# EasyEDA Pro project MasterCtrl.eprj, board MasterPCB
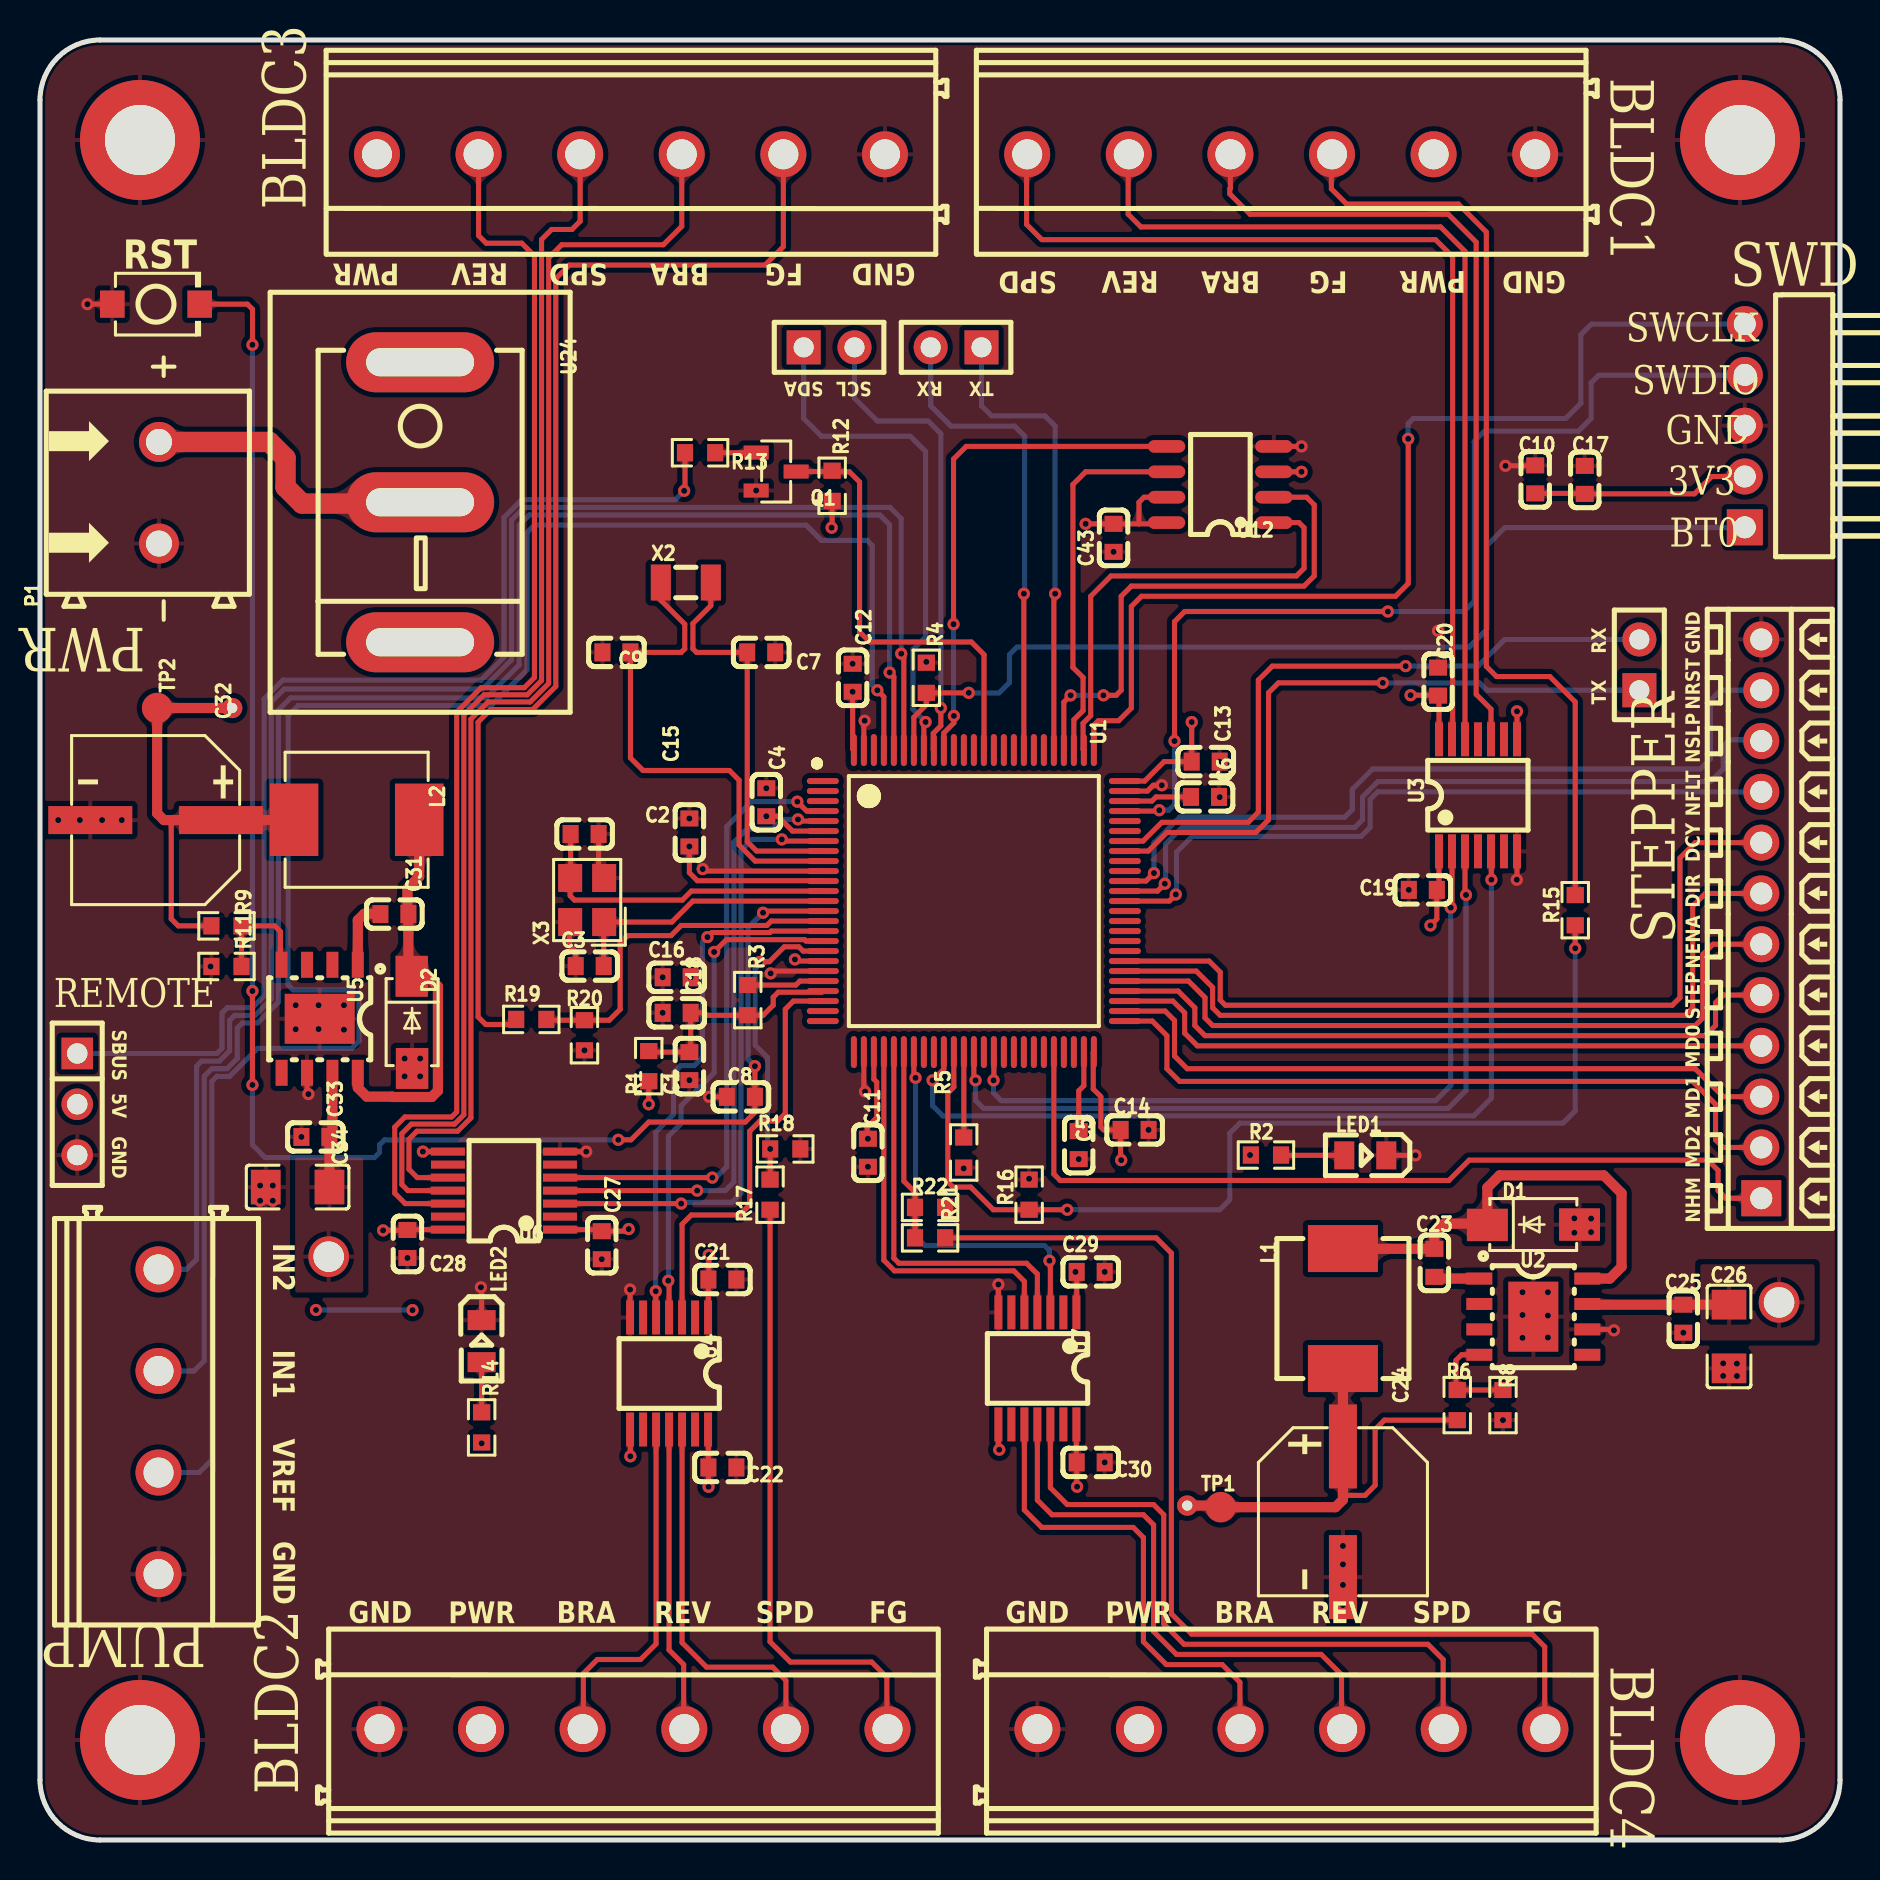
[diagram p8: board, top side]
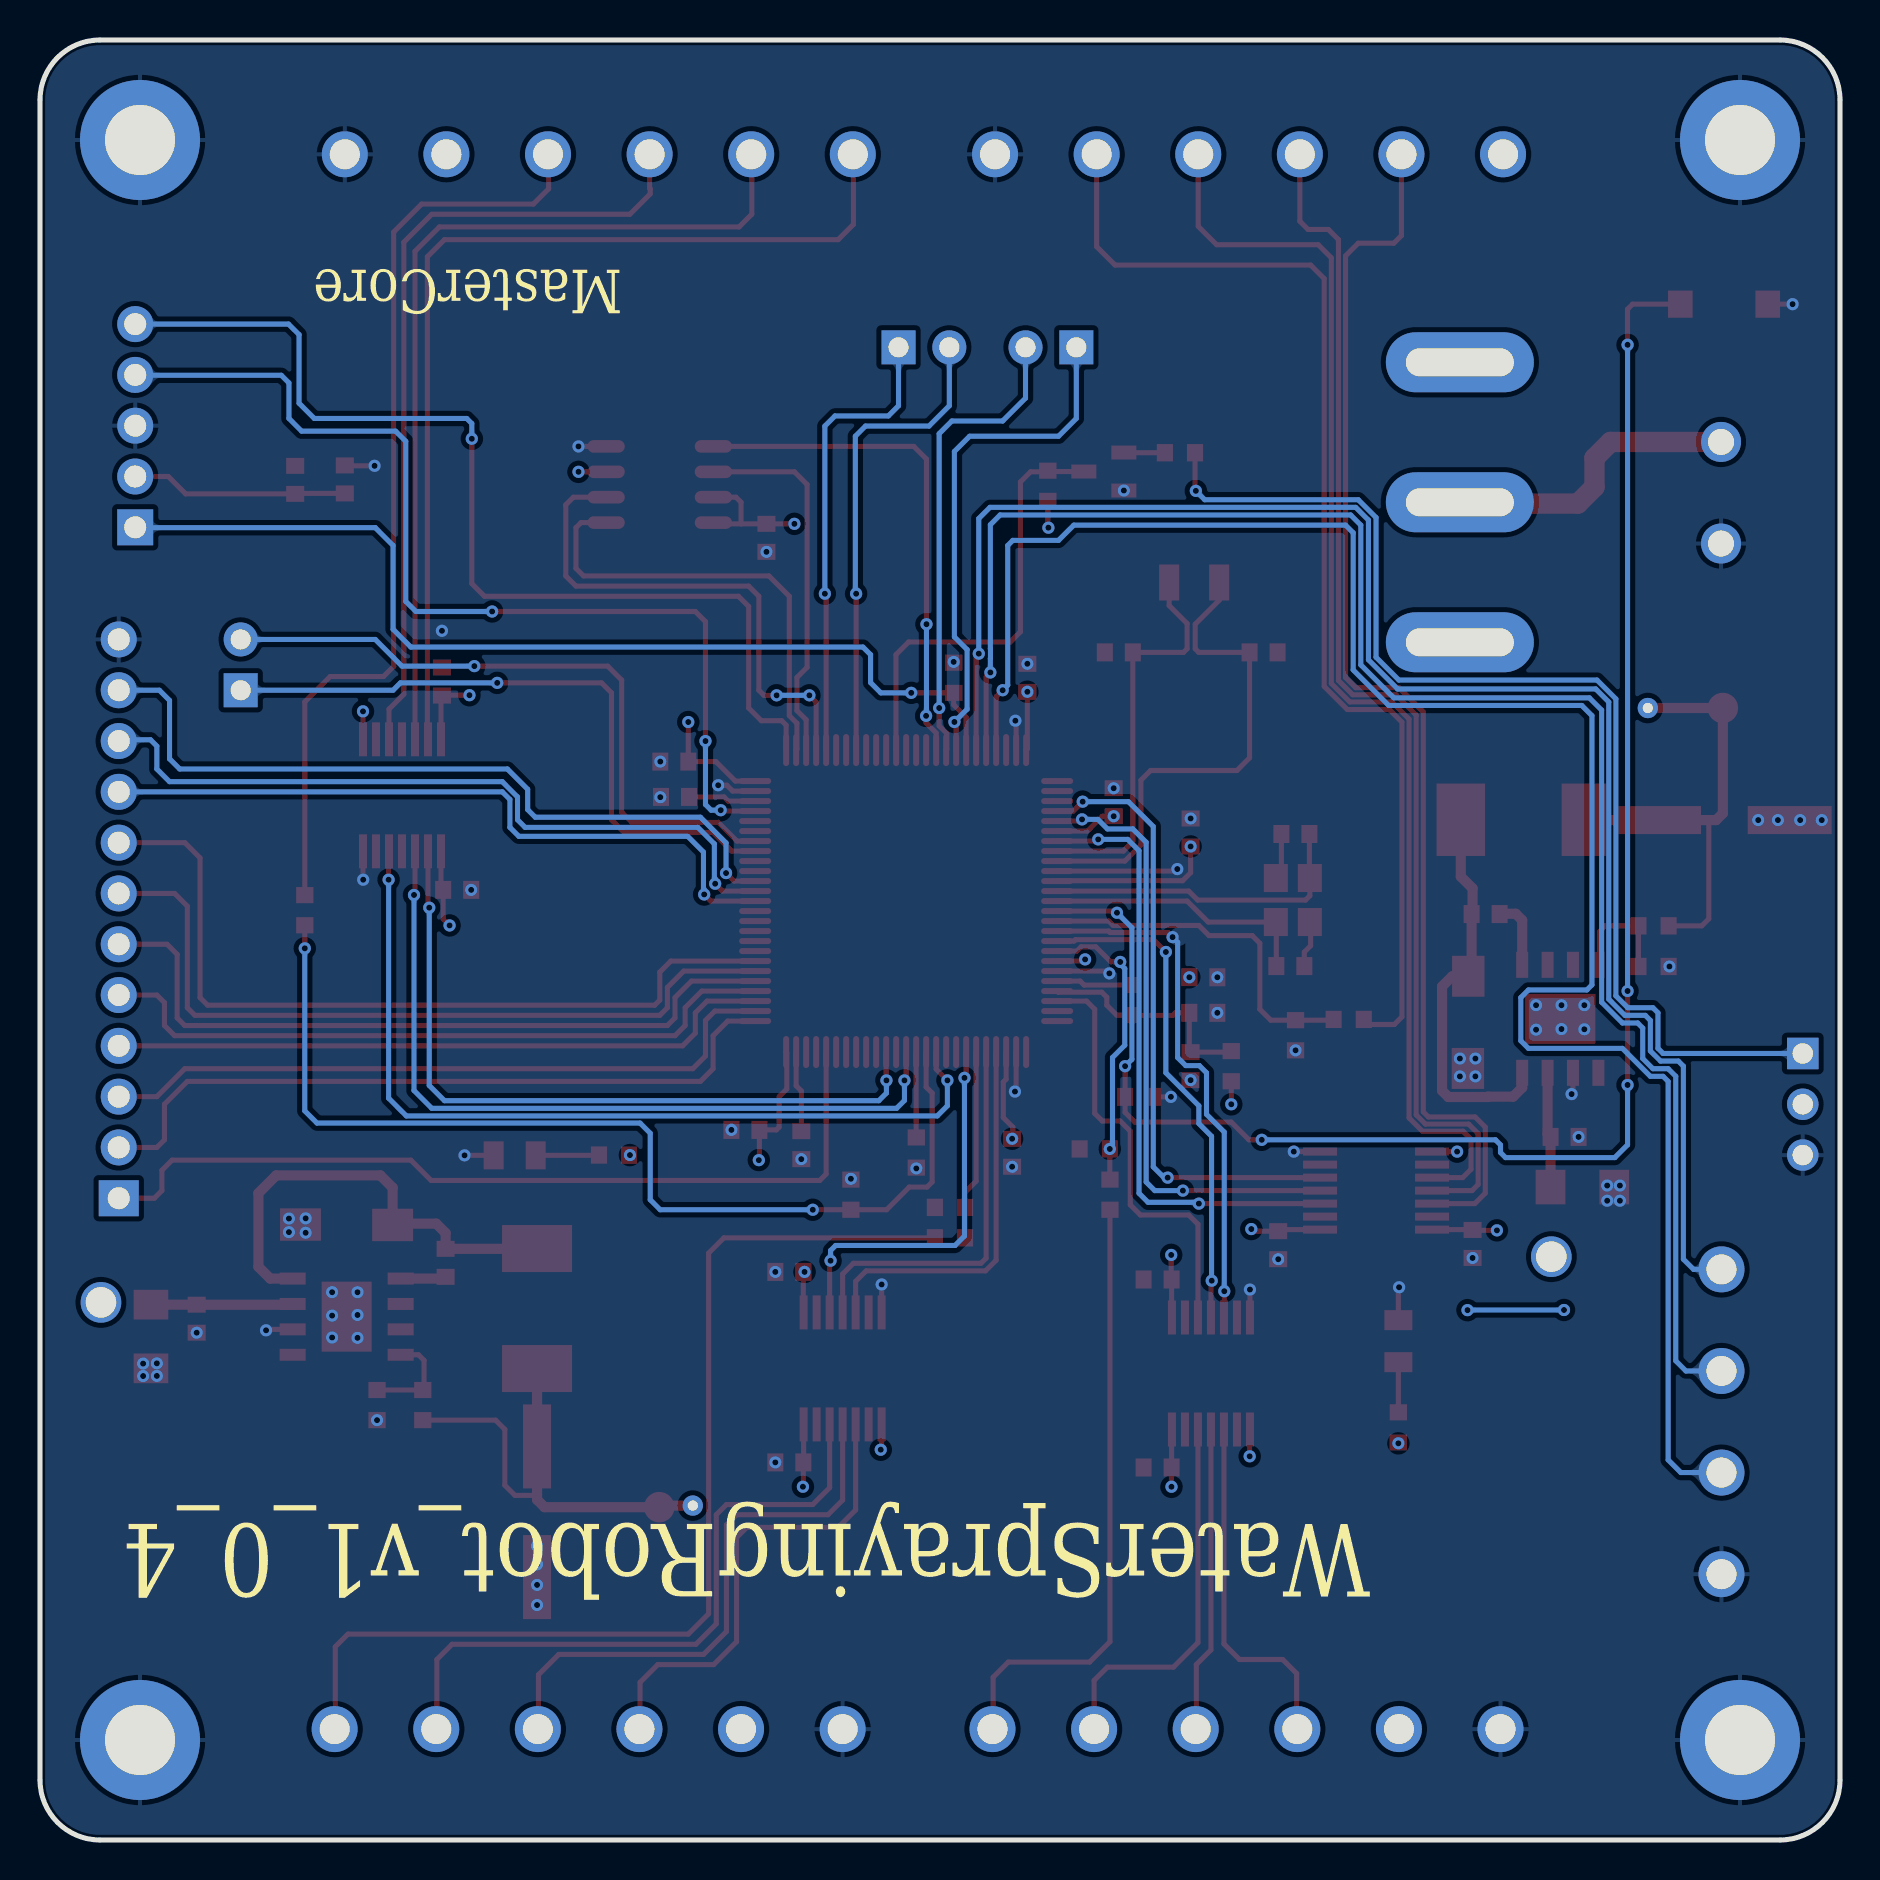
[diagram p9: board, bottom side, seen from below]

Outline 90 x 90 mm; copper layers: Top Layer, GND, PWR, Bottom Layer. Coordinates in mm from the lower left corner of the outline.
Outline path: 0,87 0,3 arc(0.88,0.88) 3,0 87,0 arc(89.12,0.88) 90,3 90,87 arc(89.12,89.12) 87,90 3,90 arc(0.88,89.12) 0,87
Stack: Top Layer 0.035mm 外层铜厚1oz / Dielectric1 0.2104mm 7628 RC49% 8.6mil / GND 0.0152mm 内层铜厚 / Dielectric2 1.065mm 1.1mm H/HOZ Copper / PWR 0.0152mm 内层铜厚 / Dielectric3 0.2104mm 7628 RC49% 8.6mil / Bottom Layer 0.035mm 外层铜厚1oz

## Design rules (mm)
template: JLCPCB Capability(Two Layers Board)
spacing copperThickness1oz (default): track to track 0.102, other pairs 0.152 to 0.3
spacing copperThickness2oz: track to track 0.203, other pairs 0.152 to 0.3
track width copperThickness1oz (default): min 0.127, default 0.254, max 2.54
track width copperThickness2oz: min 0.203, default 0.254, max 2.54
differential pair differentialPair (default): width min 0.127, default 0.254, max 2.54; gap min 0.152, default 0.152
via viaSize (default): diameter min 0.5, default 0.61, max 10; hole min 0.3, default 0.305, max 6.3

## Placement (name value [footprint] x y rotation side)
C1  100nF  [C0603]  32.47 38.69 270 top
C2  20pF  [C0603]  27.23 50.3 180 top
C3  20pF  [C0603]  27.48 43.7 0 top
C4  100nF  [C0603]  36.32 51.89 270 top
C5  2.2uF  [C0603]  51.94 34.74 90 top
C6  2.2uF  [C0603]  58.25 52.15 180 top
C7  20pF  [C0603]  36.06 59.38 180 top
C8  100nF  [C0603]  35.05 37.16 0 top
C9  20pF  [C0603]  28.82 59.38 0 top
C10  100nF  [C0603]  74.76 68.03 270 top
C11  100nF  [C0603]  41.39 34.36 90 top
C12  100nF  [C0603]  40.63 58.11 270 top
C13  100nF  [C0603]  58.29 53.92 180 top
C14  100nF  [C0603]  54.73 35.5 180 top
C15  100nF  [C0603]  32.47 50.38 270 top
C16  100nF  [C0603]  31.83 43.14 0 top
C17  10uF  [C0603]  77.24 68.01 270 top
C18  10nF  [C0603]  31.83 41.36 0 top
C19  100nF  [C0603]  69.14 47.51 180 top
C20  100nF  [C0603]  69.9 57.92 90 top
C21  100nF  [C0603]  34.12 28.02 0 top
C22  100nF  [C0603]  34.12 18.63 0 top
C23  10nF  [C0603]  69.72 28.86 270 top
C24  220uF  [CAP-SMD_BD8.0-L8.3-W8.3-FD]  65.15 16.41 270 top
C25  100nF  [C0603]  82.17 26.06 270 top
C26  10uF  [C1206]  84.45 25.17 90 top
C27  100nF  [C0603]  28.09 29.74 270 top
C28  100nF  [C0603]  18.37 29.8 270 top
C29  100nF  [C0603]  52.54 28.41 0 top
C30  100nF  [C0603]  52.54 18.88 0 top
C31  10nF  [C0603]  17.72 46.3 180 top
C32  220uF  [CAP-SMD_BD8.0-L8.3-W8.3-FD]  5.78 51 180 top
C33  100nF  [C0603]  13.77 35.15 180 top
C34  10uF  [C1206]  12.88 32.65 0 top
C43  100nF  [C0603]  53.68 65.11 90 top
CN1  DB128V-5.08-6P-GN-S  [CONN-TH_6P-P5.08_DIBO_DB128V-5.08]  62.06 84.28 180 top
CN2  DB128V-5.08-6P-GN-S  [CONN-TH_6P-P5.08_DIBO_DB128V-5.08]  29.67 5.54 0 top
CN3  DB128V-5.08-6P-GN-S  [CONN-TH_6P-P5.08_DIBO_DB128V-5.08]  29.55 84.28 180 top
CN4  DB128V-5.08-6P-GN-S  [CONN-TH_6P-P5.08_DIBO_DB128V-5.08]  62.57 5.54 0 top
CN6  DB128V-5.08-4P-GN-S  [CONN-TH_4P-P5.08_DIBO_DB128V-5.08]  5.93 20.91 270 top
D1  SS54  [SMA_L4.3-W2.6-LS5.0-FD]  74.67 30.76 180 top
D2  SS54  [SMA_L4.3-W2.6-LS5.0-FD]  18.59 40.88 90 top
H1  PZ254R-11-05P  [HDR-TH_5P-P2.54-H-M-W10.4]  85.24 70.72 90 top
H2  PM254V-11-03-H85  [HDR-TH_3P-P2.54-V-F]  1.86 36.79 270 top
L1  10uH  [IND-SMD_L7.3-W6.8]  65.15 26.57 90 top
L2  15uH  [IND-SMD_L7.0-W6.6_FXL0630]  15.83 51.01 180 top
LED1  SZYY0805R  [LED0805-R-RD]  66.26 34.23 180 top
LED2  SZYY0805R  [LED0805-R-RD]  22.08 24.94 270 top
NOREF  -  [Pad_e366]  85 85 270 top
NOREF#2  -  [Pad_e368]  85 5 270 top
NOREF#3  -  [Pad_e2298]  86.95 26.88 270 top
NOREF#4  -  [Pad_e2326]  57.36 16.72 270 top
NOREF#5  -  [Pad_e2339]  9.61 56.6 270 top
NOREF#6  -  [Pad_e369]  5 5 270 top
NOREF#7  -  [Pad_e2268]  14.44 29.17 270 top
NOREF#8  -  [Pad_e370]  5 85 270 top
P1  WJ500V-5.08-2P  [CONN-TH_2P-P5.00_WJ500V-5.08-2P]  5.95 67.36 90 top
Q1  SS8050  [SOT-23-3_L2.9-W1.3-P1.90-LS2.4-BR]  36.81 68.42 180 top
R1  0  [R0603]  30.44 38.69 90 top
R2  510  [R0603]  61.3 34.25 180 top
R3  0  [R0603]  35.39 41.99 270 top
R4  10K  [R0603]  44.32 58.11 270 top
R5  10K  [R0603]  46.19 34.37 90 top
R6  10K  [R0603]  70.86 21.75 270 top
R8  5.9kΩ  [R0603]  73.15 21.75 90 top
R9  10K  [R0603]  9.32 45.71 180 top
R11  3.24kΩ  [R0603]  9.32 43.68 0 top
R12  10K  [R0603]  39.61 67.71 270 top
R13  1K  [R0603]  33 69.36 180 top
R14  1K  [R0603]  22.08 20.63 270 top
R15  1K  [R0603]  76.76 46.49 270 top
R16  1.5K  [R0603]  49.46 32.27 90 top
R17  1K  [R0603]  36.5 32.27 90 top
R18  1.5K  [R0603]  37.26 34.55 0 top
R19  1K  [R0603]  24.56 41.03 0 top
R20  1.5K  [R0603]  27.22 40.24 270 top
R21  1K  [R0603]  44.5 30.11 180 top
R22  1.5K  [R0603]  44.5 31.63 0 top
SW1  TS-1088-AR02016  [SW-SMD_L3.9-W3.0-P4.45]  5.8 76.79 0 top
TP1  -  [Test-Point-0.5mm]  59.04 16.64 0 top
TP2  -  [Test-Point-0.5mm]  5.86 56.6 270 top
U1  STM32F407VET6TR  [LQFP-100_L14.0-W14.0-P0.50-LS16.0-BL]  46.69 46.95 270 top
U2  TPS5430DDAR  [ESOP-8_L4.9-W3.9-P1.27-LS6.0-TL-EP]  74.67 26.17 0 top
U3  RS0104YQ  [TSSOP-14_L5.0-W4.4-P0.65-LS6.4-BL]  71.9 52.24 0 top
U4  RS0104YQ  [TSSOP-14_L5.0-W4.4-P0.65-LS6.4-BL]  31.45 23.32 180 top
U5  TPS5430DDAR  [ESOP-8_L4.9-W3.9-P1.27-LS6.0-TL-EP]  13.99 41.06 270 top
U6  RS0104YQ  [TSSOP-14_L5.0-W4.4-P0.65-LS6.4-BL]  23.2 32.47 90 top
U7  RS0104YQ  [TSSOP-14_L5.0-W4.4-P0.65-LS6.4-BL]  49.87 23.58 180 top
U12  W25Q16JVSNIQ  [SOP-8_L4.9-W3.9-P1.27-LS6.0-BL]  59.01 67.78 90 top
U13  MX128-2.54-12P-GN01-Cu-Y-A  [CONN-TH_12P-P2.54_MX128-2.54-12P-GN01-CU-Y-A]  86.06 46.06 90 top
U24  RS601-1020011BB  [SW-TH_RS601-1020011BB]  19.01 66.89 270 top
U26  ZX-PM2.54-1-2PY  [HDR-TH_2P-P2.54-V-F]  79.97 58.76 90 top
U27  ZX-PM2.54-1-2PY  [HDR-TH_2P-P2.54-V-F]  39.45 74.63 0 top
U28  ZX-PM2.54-1-2PY  [HDR-TH_2P-P2.54-V-F]  45.8 74.63 180 top
X2  32.768kHz  [FC-135R_L3.2-W1.5]  32.29 62.87 0 top
X3  12MHz  [CRYSTAL-SMD_4P-L3.2-W2.5-BL]  27.36 47 90 top

## Footprints (pads in the part's own frame, mm; a bottom-side part is the same pattern mirrored in y, then rotated)
C0603
  rect 0.8x0.9 smd: 1(-0.7,0) 2(0.7,0)
C1206
  rect 1.485x1.728 smd: 1(-1.593,0) 2(1.593,0)
CAP-SMD_BD8.0-L8.3-W8.3-FD
  rect 4.2x1.4 smd: 1(-3.267,0) 2(3.267,0)
CONN-TH_2P-P5.00_WJ500V-5.08-2P
  round 2 hole 1.3: 1(-2.54,0) 2(2.54,0)
CONN-TH_4P-P5.08_DIBO_DB128V-5.08
  round 2.3 hole 1.5: 1(-7.62,0) 2(-2.54,0) 3(2.54,0) 4(7.62,0)
CONN-TH_6P-P5.08_DIBO_DB128V-5.08
  round 2.3 hole 1.5: 1(-12.7,0) 2(-7.62,0) 3(-2.54,0) 4(2.54,0) 5(7.62,0) 6(12.7,0)
CONN-TH_12P-P2.54_MX128-2.54-12P-GN01-CU-Y-A
  rect 1.8x2 hole 1.1: 1(-13.97,0)
  round 1.8 hole 1.1: 2(-11.43,0) 3(-8.89,0) 4(-6.35,0) 5(-3.81,0) 6(-1.27,0) 7(1.27,0) 8(3.81,0) 9(6.35,0) 10(8.89,0) 11(11.43,0) 12(13.97,0)
CRYSTAL-SMD_4P-L3.2-W2.5-BL
  rect 1.4x1.2 smd: 1(-1.1,-0.85) 2(1.1,-0.85) 3(1.1,0.85) 4(-1.1,0.85)
ESOP-8_L4.9-W3.9-P1.27-LS6.0-TL-EP
  rect 1.3x0.6 smd: 1(-2.7,1.905) 2(-2.7,0.635) 3(-2.7,-0.635) 4(-2.7,-1.905) 5(2.7,-1.905) 6(2.7,-0.635) 7(2.7,0.635) 8(2.7,1.905)
  rect 2.5x3.5 smd: 9(0,0)
FC-135R_L3.2-W1.5
  rect 1x1.8 smd: 1(-1.25,0) 2(1.25,0)
HDR-TH_2P-P2.54-V-F
  rect 1.7x1.7 hole 1: 1(-1.27,0)
  round 1.7 hole 1: 2(1.27,0)
HDR-TH_3P-P2.54-V-F
  rect 1.575x1.575 hole 1.02: 1(-2.54,0)
  round 1.575 hole 1.02: 2(0,0) 3(2.54,0)
HDR-TH_5P-P2.54-H-M-W10.4
  rect 1.8x1.8 hole 1.1: 1(-5.08,0)
  round 1.8 hole 1.1: 2(-2.54,0) 3(0,0) 4(2.54,0) 5(5.08,0)
IND-SMD_L7.0-W6.6_FXL0630
  rect 2.424x3.62 smd: 1(3.128,0) 2(-3.128,0)
IND-SMD_L7.3-W6.8
  rect 2.35x3.5 smd: 1(-3,0) 2(3,0)
LED0805-R-RD
  rect 1x1.399 smd: 1(1.05,0) 2(-1.05,0)
LQFP-100_L14.0-W14.0-P0.50-LS16.0-BL
  oval 0.3x1.6 smd: 1(-6,-7.55) 2(-5.5,-7.55) 3(-5,-7.55) 4(-4.5,-7.55) 5(-4,-7.55) 6(-3.5,-7.55) 7(-3,-7.55) 8(-2.5,-7.55) 9(-2,-7.55) 10(-1.5,-7.55) 11(-1,-7.55) 12(-0.5,-7.55) 13(0,-7.55) 14(0.5,-7.55) 15(1,-7.55) 16(1.5,-7.55) 17(2,-7.55) 18(2.5,-7.55) 19(3,-7.55) 20(3.5,-7.55) 21(4,-7.55) 22(4.5,-7.55) 23(5,-7.55) 24(5.5,-7.55) 25(6,-7.55) 51(6,7.55) 52(5.5,7.55) 53(5,7.55) 54(4.5,7.55) 55(4,7.55) 56(3.5,7.55) 57(3,7.55) 58(2.5,7.55) 59(2,7.55) 60(1.5,7.55) 61(1,7.55) 62(0.5,7.55) 63(0,7.55) 64(-0.5,7.55) 65(-1,7.55) 66(-1.5,7.55) 67(-2,7.55) 68(-2.5,7.55) 69(-3,7.55) 70(-3.5,7.55) 71(-4,7.55) 72(-4.5,7.55) 73(-5,7.55) 74(-5.5,7.55) 75(-6,7.55)
  oval 1.6x0.3 smd: 26(7.55,-6) 27(7.55,-5.5) 28(7.55,-5) 29(7.55,-4.5) 30(7.55,-4) 31(7.55,-3.5) 32(7.55,-3) 33(7.55,-2.5) 34(7.55,-2) 35(7.55,-1.5) 36(7.55,-1) 37(7.55,-0.5) 38(7.55,0) 39(7.55,0.5) 40(7.55,1) 41(7.55,1.5) 42(7.55,2) 43(7.55,2.5) 44(7.55,3) 45(7.55,3.5) 46(7.55,4) 47(7.55,4.5) 48(7.55,5) 49(7.55,5.5) 50(7.55,6) 76(-7.55,6) 77(-7.55,5.5) 78(-7.55,5) 79(-7.55,4.5) 80(-7.55,4) 81(-7.55,3.5) 82(-7.55,3) 83(-7.55,2.5) 84(-7.55,2) 85(-7.55,1.5) 86(-7.55,1) 87(-7.55,0.5) 88(-7.55,0) 89(-7.55,-0.5) 90(-7.55,-1) 91(-7.55,-1.5) 92(-7.55,-2) 93(-7.55,-2.5) 94(-7.55,-3) 95(-7.55,-3.5) 96(-7.55,-4) 97(-7.55,-4.5) 98(-7.55,-5) 99(-7.55,-5.5) 100(-7.55,-6)
Pad_e366
  round 6 hole 3.5: 1(0,0)
Pad_e368
  round 6 hole 3.5: 1(0,0)
Pad_e369
  round 6 hole 3.5: 1(0,0)
Pad_e370
  round 6 hole 3.5: 1(0,0)
Pad_e2268
  round 2.032 hole 1.524: 1(0,0)
Pad_e2298
  round 2.032 hole 1.524: 1(0,0)
Pad_e2326
  round 1.016 hole 0.508: 1(0,0)
Pad_e2339
  round 1.016 hole 0.508: 1(0,0)
R0603
  rect 0.806x0.864 smd: 1(-0.753,0) 2(0.753,0)
SMA_L4.3-W2.6-LS5.0-FD
  rect 2.046x1.62 smd: 1(-2.304,-0.009) 2(2.304,0.009)
SOP-8_L4.9-W3.9-P1.27-LS6.0-BL
  oval 0.63x1.865 smd: 1(-1.905,-2.683) 2(-0.635,-2.683) 3(0.635,-2.683) 4(1.905,-2.683) 5(1.905,2.683) 6(0.635,2.683) 7(-0.635,2.683) 8(-1.905,2.683)
SOT-23-3_L2.9-W1.3-P1.90-LS2.4-BR
  rect 1.25x0.7 smd: 1(1,-0.95) 2(1,0.95) 3(-1,0)
SW-SMD_L3.9-W3.0-P4.45
  rect 1.23x1.36 smd: 1(-2.185,0) 2(2.185,0)
SW-TH_RS601-1020011BB
  oval 3x7.4 hole 1.4x5.4: 1(-7,0) 2(0,0) 3(7,0)
Test-Point-0.5mm
  round 1.524 smd: 1(0,0)
TSSOP-14_L5.0-W4.4-P0.65-LS6.4-BL
  rect 0.4x1.7 smd: 1(-1.95,-2.8) 2(-1.3,-2.8) 3(-0.65,-2.8) 4(0,-2.8) 5(0.65,-2.8) 6(1.3,-2.8) 7(1.95,-2.8) 8(1.95,2.8) 9(1.3,2.8) 10(0.65,2.8) 11(0,2.8) 12(-0.65,2.8) 13(-1.3,2.8) 14(-1.95,2.8)

## Nets
As in the schematic, except:
3V3: C4.2 C10.2 C11.2 C12.2 C13.2 C14.2 C15.2 C16.2 C17.2 C19.1 C21.1 C24.1 C27.1 C29.1 C43.2 H1.2 L1.1 NOREF#4.1 R1.1 R2.2 R6.2 R12.2 TP1.1 U1.6 U1.11 U1.19 U1.28 U1.50 U1.75 U1.100 U3.1 U3.8 U4.1 U4.8 U6.1 U6.8 U7.1 U7.8 U12.3 U12.7 U12.8
5V: C20.1 C22.1 C28.1 C30.1 C32.1 H2.2 L2.1 NOREF#5.1 R9.2 R14.2 TP2.1 U3.14 U4.14 U6.14 U7.14
GND: C1.2 C2.1 C3.1 C4.1 C5.1 C6.1 C7.1 C8.1 C9.1 C10.1 C11.1 C12.1 C13.1 C14.1 C15.1 C16.1 C17.1 C18.1 C19.2 C20.2 C21.2 C22.2 C24.2 C25.2 C26.1 C27.2 C28.2 C29.2 C30.2 C32.2 C33.2 C34.1 C43.1 CN1.1 CN2.1 CN3.1 CN4.1 CN6.4 D1.1 D2.1 H1.3 H2.3 LED1.2 LED2.2 NOREF.1 NOREF#2.1 NOREF#6.1 NOREF#8.1 P1.1 Q1.2 R4.1 R5.1 R8.1 R11.1 R16.2 R18.2 R20.2 R22.2 SW1.1 U1.10 U1.20 U1.27 U1.74 U1.99 U2.6 U2.9 U3.7 U4.7 U5.6 U5.9 U6.7 U7.7 U12.4 U13.12 X3.2 X3.4
VIN_24V: C25.1 C26.2 C33.1 C34.2 NOREF#3.1 NOREF#7.1 U2.7 U5.7 U24.3

Pads without a net: U1 1 2 3 24 25 26 33 34 39 41 42 43 44 45 47 48 58 59 60 61 62 66 67 70 71 81 82 84 85 86 88 89 90 98; U2 2 3 5; U3 4 6 9 11; U4 2 6 9 13; U5 2 3 5; U6 2 6 9 13; U7 2 6 9 13; U24 1

## Via types
v1: diameter 0.61, hole 0.305, Top Layer to Bottom Layer, 158 vias

## Routing (per net, layer and track width the routed paths; a pad name or vN(x,y) marks a point on that pad's centre or on a via; arc(x,y) is an arc through that point)
3V3: length 95.4
  Top Layer w0.254: U4.8 29.52,20.51 v1(29.52,19.19) ; v1(33.44,29.25) 33.44,28.04 C21.1 33.42,26.14 U4.1 ; v1(32.47,49.68) 32.47,48.36 32.87,47.96 39.13,47.96 U1.11 ; v1(69.52,45.73) 69.84,46.05 C19.1 69.95,47.61 U3.1 ; U6.8 v1(19.15,34.42) ; v1(47.96,19.51) 47.92,19.56 47.92,20.78 ; v1(51.77,28.41) C29.1 51.83,26.4 U7.1 ; R1.1 v1(30.44,36.79) ; 54.94,65.81 54.95,65.82 54.95,66.89 55.2,67.14 U12.7 ; 54.94,65.81 C43.2 v1(52.28,65.81) ; 54.94,65.81 56.27,65.81 U12.8 ; R12.2 39.61,65.64 v1(39.58,65.62) ; U1.28 41.69,38.04 41.84,37.9 41.84,36.12 41.36,35.64 41.36,35.1 v1(41.39,35.06) ; U3.8 v1(73.85,56.43) ; 61.69,68.41 v1(63.08,68.41) ; v1(37.75,44.03) 37.83,43.95 U1.19 ; R6.2 67.22,20.99 66.76,20.53 66.76,17.74 66.25,17.23 65.2,17.23 65.15,17.28 ; U6.1 28.01,30.52 C27.1 29.33,30.44 v1(29.43,30.55) ; H1.2 83.59,68.17 82.72,67.31 C17.2 77.22,67.33 C10.2 ; v1(36.32,51.19) 36.88,51.19 37.63,50.45 U1.6 ; v1(54.06,33.99) 54.03,34.02 C14.2 53.18,35.5 53.04,35.64 53.04,37.17 52.66,37.55 52.66,39.37 U1.50 ; U1.75 55.23,52.95 56.21,53.92 57.59,53.92 v1(57.59,55.9) ; 40.74,57.36 40.69,57.41 v1(40.63,57.41) 40.63,54.56 U1.100
  Top Layer w0.508: L1.1 C24.1 65.15,17.01 64.77,16.64 TP1.1 58.96,16.72 NOREF#4.1
  vias: v1(32.53,43.14) v1(60.5,34.25)
5V: length 198.3
  Top Layer w0.254: v1(51.85,17.66) 51.83,17.68 C30.1 51.82,18.9 U7.14 ; v1(33.43,17.66) 33.43,18.62 C22.1 33.42,20.51 U4.14 ; 6.52,51 6.56,50.96 6.56,46.06 6.91,45.71 R9.2 ; U3.14 69.95,57.17 C20.1 69.88,57.24 v1(68.53,57.24) ; v1(17.15,30.48) 18.35,30.48 C28.1 18.39,30.52 U6.14
  Top Layer w0.508: L2.1 12.69,51 C32.1 6.2,51 5.86,51.33 TP2.1 9.48,56.6 9.61,56.47
  PWR w0.254: H2.2 3.51,36.79 3.89,36.41 3.89,27.64 5.04,26.5 v1(13.8,26.5) ; v1(22.08,19.84) 22.08,17.67 22.08,17.66 ; 22.08,17.66 19.48,17.66 18.63,18.52 v1(18.63,26.49) 18.63,27.9 18.09,28.43 18.09,28.43 17.15,29.37 v1(17.15,30.48) 17.1,30.53 17.1,55.96 16.47,56.6 NOREF#5.1 ; 22.08,17.66 v1(33.43,17.66) v1(51.85,17.66) 55.64,17.66 56.22,18.25 56.22,39.96 57.23,40.98 64.09,40.98 64.6,41.49 64.6,56.43 65.41,57.24 v1(68.53,57.24)
  Bottom Layer w0.254: v1(18.63,26.49) 18.62,26.5 v1(13.8,26.5)
GND: length 34.9
  Top Layer w0.254: U1.74 55.37,52.45 55.66,52.74 v1(56.09,52.74) ; v1(41.23,55.96) 41.19,55.92 U1.99 ; U1.10 33.24,48.45 v1(33.14,48.55) ; v1(22.05,27.64) 22.08,27.6 LED2.2 ; U2.6 78.65,25.53 v1(78.7,25.48) ; U6.7 v1(27.31,34.42) ; U1.27 41.19,37.48 v1(41.25,37.42) ; U12.4 v1(63.08,69.68) ; v1(73.27,68.71) 74.74,68.71 C10.1 ; U5.6 13.35,37.36 v1(13.42,37.3) ; U4.7 v1(29.5,27.52) ; 28.21,48.1 27.93,48.38 C2.1 ; v1(2.37,76.79) SW1.1 ; C3.1 26.79,44.4 26.47,44.71 26.47,45.86 26.51,45.9 ; U1.20 36.65,43.45 v1(36.53,43.33) ; 47.92,26.38 v1(47.92,27.78) ; C8.1 v1(33.46,37.16) ; v1(73.84,48.01) 73.85,48.02 U3.7 ; LED1.2 v1(68.77,34.23)
  vias: v1(0.91,51) v1(1.99,51) v1(3.1,51) v1(4.09,51) v1(8.53,43.68) v1(11.01,32.72) v1(11.01,31.96) v1(11.64,32.72) v1(11.64,31.96) v1(12.78,41.74) v1(12.78,40.54) v1(13.07,35.15) v1(13.93,41.74) v1(13.93,40.55) v1(15.2,41.74) v1(15.2,40.52) v1(18.23,39.07) v1(18.23,38.18) v1(18.37,29.1) v1(19.01,39.07) v1(19.01,38.18) v1(27.22,39.48) v1(28.09,29.04) v1(31.13,43.14) v1(31.13,41.36) v1(32.47,51.08) v1(32.47,37.99) v1(35.81,67.47) v1(36.32,52.59) v1(40.63,58.81) v1(41.39,33.66) v1(44.32,58.91) v1(46.19,33.58) v1(49.46,33.06) v1(51.94,34.04) v1(53.23,28.41) v1(53.23,18.88) v1(53.68,64.41) v1(55.43,35.5) v1(58.99,53.92) v1(58.99,52.14) v1(65.15,14.7) v1(65.15,13.78) v1(65.15,12.75) v1(65.15,11.75) v1(68.44,47.51) v1(69.9,60.46) v1(73.15,20.99) v1(74.13,27.39) v1(74.13,26.25) v1(74.13,25.11) v1(75.39,27.39) v1(75.39,26.22) v1(75.39,25.12) v1(76.72,31.08) v1(76.72,30.36) v1(77.55,31.07) v1(77.55,30.39) v1(82.17,25.36) v1(84.16,23.83) v1(84.16,23.2) v1(84.84,23.82) v1(84.84,23.2)
VDDA: length 11.4
  Top Layer w0.254: U1.22 39.09,42.39 36.91,42.39 36.66,42.14 36.66,41.74 36.16,41.24 R3.2 35.38,41.23 33.36,41.23 33.23,41.36 C18.2 32.53,39.46 C1.1 30.49,39.39 R1.2
VIN_24V: length 165.2
  Top Layer w0.508: U5.7 14.62,35.3 C33.1 ; U2.7 77.4,26.76 C25.1 82.17,26.77 C26.2 ; 14.47,35.15 C34.2
  PWR w1.524: U24.3 10.86,59.89 6.69,55.71 6.69,30.82 8.4,29.1 14.37,29.1 NOREF#7.1 15.83,29.17 17.1,27.9 17.1,12.66 19.52,10.24 85.17,10.24 86.95,12.02 NOREF#3.1
BLDC1_BRA: length 40.5
  Top Layer w0.254: U3.10 72.55,56.54 71.81,57.28 71.81,79.89 70.41,81.29 60.51,81.29 59.49,82.3 59.49,82.56 59.52,82.59 CN1.4
BLDC1_BRA_3V3: length 43.8
  Top Layer w0.254: v1(44.63,37.98) 45.19,38.54 U1.35 ; U3.5 72.57,49.42 v1(72.57,48.01)
  Bottom Layer w0.254: v1(72.57,48.01) 72.57,37.09 71.68,36.2 45.14,36.2 44.63,36.71 v1(44.63,37.98)
BLDC1_FG: length 46.9
  Top Layer w0.254: R15.1 76.76,56.9 75.49,58.17 72.82,58.17 72.32,58.68 72.32,80.4 70.92,81.8 65.33,81.8 64.57,82.56 64.57,84.25 CN1.3
BLDC1_FG_3V3: length 51.8
  Top Layer w0.254: v1(51.36,31.51) R16.1 47.67,31.51 46.54,32.65 45.65,32.65 45.39,32.9 45.39,37.35 45.69,37.65 U1.36 ; v1(76.76,44.58) R15.2
  Bottom Layer w0.254: v1(51.36,31.51) 58.99,31.51 59.49,32.01 59.49,35.34 60,35.85 76.15,35.85 76.76,36.46 v1(76.76,44.58)
BLDC1_PWM: length 49.6
  Top Layer w0.254: CN1.6 49.33,84.25 49.33,80.78 50.09,80.02 69.78,80.02 70.63,79.16 70.63,55.07 70.6,55.04
BLDC1_PWM_3V3: length 37.1
  Top Layer w0.254: v1(47.68,37.98) 47.69,38 U1.40 ; v1(70.54,46.62) 70.6,46.68 70.6,49.44
  Bottom Layer w0.254: v1(47.68,37.98) 47.68,37.35 48.06,36.97 69.78,36.97 70.54,37.73 v1(70.54,46.62)
BLDC1_REV: length 45
  Top Layer w0.254: CN1.5 54.41,84.25 54.41,81.29 55.04,80.65 70.03,80.65 71.25,79.43 U3.12
BLDC1_REV_3V3: length 39.5
  Top Layer w0.254: U1.38 46.69,38.06 v1(46.78,37.98) ; v1(71.3,47.25) 71.25,47.3 U3.3
  Bottom Layer w0.254: v1(71.3,47.25) 71.3,37.47 70.41,36.58 47.17,36.58 46.78,36.98 v1(46.78,37.98)
BLDC2_BRA: length 17.8
  Top Layer w0.254: CN2.3 27.17,5.58 27.17,8.33 27.87,9.03 30.02,9.03 30.8,9.8 U4.10
BLDC2_BRA_3V3: length 26.4
  Top Layer w0.254: v1(33.37,45.14) 33.6,45.37 36.49,45.37 36.57,45.45 U1.16 ; v1(30.79,27.44) 30.79,26.14 U4.5
  Bottom Layer w0.254: v1(33.37,45.14) 33.12,44.89 33.12,39.12 32.71,38.72 32.03,38.72 31.68,38.36 31.68,36.28 30.79,35.4 v1(30.79,27.44)
BLDC2_FG: length 30.8
  Top Layer w0.254: R17.1 36.5,9.91 37.52,8.9 41.58,8.9 42.34,8.14 42.34,5.58 CN2.6
BLDC2_FG_3V3: length 14.8
  Top Layer w0.254: v1(35.99,43.9) 36.28,43.9 36.29,43.91 36.47,43.91 37.21,44.66 37.94,44.66 38.16,44.45 U1.18 ; v1(36.51,34.55) 36.51,33.03 R17.2
  Bottom Layer w0.254: v1(35.99,43.9) 35.99,43.8 35.76,43.57 35.76,39.74 36.38,39.12 36.38,34.69 v1(36.51,34.55)
BLDC2_PWM: length 19.1
  Top Layer w0.254: U4.12 32.1,9.87 33.33,8.64 36.63,8.64 37.3,7.98 CN2.5
BLDC2_PWM_3V3: length 21.5
  Top Layer w0.254: U1.23 37.67,41.95 37.26,41.54 37.26,36.33 36.88,35.95 35.99,35.95 35.49,35.44 35.49,31.76 34.98,31.25 32.57,31.25 32.1,30.79 U4.3
BLDC2_REV: length 15.3
  Top Layer w0.254: U4.11 31.45,9.5 32.18,8.77 32.18,5.58 CN2.4
BLDC2_REV_3V3: length 25
  Top Layer w0.254: U4.4 31.45,27.93 v1(31.41,27.96) ; v1(33.71,44.4) 34.32,45.02 38.23,45.02 38.3,44.95 U1.17
  Bottom Layer w0.254: v1(33.71,44.4) 33.71,38.36 32.06,36.71 32.06,35.82 31.42,35.19 31.42,27.97 v1(31.41,27.96)
BLDC3_BRA: length 63.9
  Top Layer w0.254: CN3.3 32.09,80.68 31.17,79.76 26.09,79.76 25.43,79.11 25.43,57.83 24.51,56.9 22.41,56.9 21.55,56.05 21.55,36.11 21.52,36.08 21.52,36.08 20.88,35.44 18.85,35.44 18.45,35.04 18.45,33.54 18.87,33.12 U6.10
BLDC3_BRA_3V3: length 31.1
  Top Layer w0.254: v1(37.86,51.92) 38.34,51.45 U1.4 ; U6.5 v1(33.62,33.12)
  Bottom Layer w0.254: v1(37.86,51.92) 35.58,51.92 34.34,50.67 34.34,33.66 33.83,33.16 33.65,33.16 v1(33.62,33.12)
BLDC3_FG: length 58.6
  Top Layer w0.254: R19.1 23.56,40.78 22.28,40.78 21.9,41.16 21.9,55.89 22.53,56.52 24.63,56.52 25.79,57.68 25.79,78.07 26.47,78.75 36.25,78.75 37.17,79.67 CN3.2
BLDC3_FG_3V3: length 17.8
  Top Layer w0.254: U1.15 36.56,45.95 36.34,45.73 32.06,45.73 31.55,45.22 29.39,45.22 29.01,44.84 29.01,41.54 28.46,40.99 R20.1 25.36,40.99 R19.2
BLDC3_PWM: length 60.8
  Top Layer w0.254: CN3.4 27.01,80.94 26.6,80.53 25.58,80.53 25.08,80.02 25.08,57.98 24.36,57.26 22.2,57.26 21.19,56.25 21.19,36.26 20.73,35.8 18.57,35.8 18.09,35.32 18.09,32.77 18.4,32.47 U6.11
BLDC3_PWM_3V3: length 30.8
  Top Layer w0.254: U6.4 v1(32.86,32.47) ; U1.5 37.98,50.95 v1(37.9,51.03)
  Bottom Layer w0.254: v1(32.86,32.47) 34.26,32.47 34.69,32.9 34.69,49.89 35.36,50.55 36.63,50.55 37.11,51.03 v1(37.9,51.03)
BLDC3_REV: length 62.5
  Top Layer w0.254: U6.12 18.26,31.82 17.74,32.34 17.74,35.64 18.25,36.15 20.58,36.15 20.83,36.41 20.83,56.39 22.05,57.61 24.21,57.61 24.72,58.12 24.72,79.2 24.09,79.84 22.31,79.84 21.93,80.22 CN3.5
BLDC3_REV_3V3: length 30.8
  Top Layer w0.254: v1(37.09,50.03) 37.17,49.95 U1.7 ; v1(32.06,31.82) U6.3
  Bottom Layer w0.254: v1(37.09,50.03) 35.61,50.03 35.05,49.47 35.05,32.34 34.6,31.89 32.12,31.89 v1(32.06,31.82)
BLDC4_BRA: length 24
  Top Layer w0.254: U7.10 49.22,16.5 50.09,15.63 54.66,15.63 55.17,15.12 55.17,9.91 56.31,8.77 59.11,8.77 60,7.88 60,5.58 CN4.3
BLDC4_BRA_3V3: length 19.4
  Top Layer w0.254: U7.5 49.22,27.93 48.69,28.46 42.73,28.46 42.19,28.99 U1.29
BLDC4_FG: length 53.1
  Top Layer w0.254: 75.27,5.54 75.24,5.58 75.24,9.66 74.6,10.29 57.58,10.29 56.57,11.31 56.57,29.34 55.81,30.11 R21.1
BLDC4_FG_3V3: length 9.5
  Top Layer w0.254: U1.31 43.19,32.94 43.75,32.38 R22.1 R21.2
BLDC4_PWM: length 33.1
  Top Layer w0.254: U7.12 50.52,17.62 51.36,16.77 55.68,16.77 56.19,16.26 56.19,10.8 57.2,9.79 69.39,9.79 70.16,9.03 70.16,5.58 CN4.5
BLDC4_PWM_3V3: length 19.3
  Top Layer w0.254: v1(50.47,28.96) 50.52,28.92 U7.3 ; v1(43.78,38.11) 43.69,38.19 U1.32
  Bottom Layer w0.254: v1(50.47,28.96) 50.47,29.47 50.22,29.73 44.25,29.73 43.78,30.2 v1(43.78,38.11)
BLDC4_REV: length 28.5
  Top Layer w0.254: U7.11 49.87,17 50.6,16.26 55.17,16.26 55.68,15.76 55.68,10.42 56.82,9.28 64.06,9.28 65.08,8.26 65.08,5.58 CN4.4
BLDC4_REV_3V3: length 19.7
  Top Layer w0.254: U7.4 49.87,28.3 49.33,28.84 42.95,28.84 42.69,29.09 U1.30
BOOT0: length 50.7
  Top Layer w0.254: v1(46.44,57.36) R4.2 44.32,56.76 43.69,56.14 U1.94
  Bottom Layer w0.254: H1.1 85.22,65.62 73.24,65.62 72.35,64.73 72.35,60.54 71.46,59.65 48.85,59.65 48.47,59.27 48.47,57.87 47.96,57.36 v1(46.44,57.36)
I2C1_SCL: length 23.6
  Top Layer w0.254: v1(45.04,56.6) 45.04,55.71 44.66,55.33 44.66,54.53 U1.92
  Bottom Layer w0.254: v1(45.04,56.6) 45.04,70.31 44.41,70.95 41.87,70.95 40.72,72.09 U27.2
I2C1_SDA: length 25.8
  Top Layer w0.254: U1.93 44.19,55.81 v1(44.28,55.9)
  Bottom Layer w0.254: 38.18,74.63 38.18,71.08 39.07,70.19 43.52,70.19 44.28,69.43 44.28,60.16 43.64,59.52 43.64,56.54 v1(44.28,55.9)
MC7RE_SBUS: length 57.7
  Top Layer w0.254: R13.2 32.25,67.5 v1(32.21,67.46)
  Bottom Layer w0.254: v1(32.21,67.46) 31.76,67.01 24.09,67.01 23.2,66.12 23.2,59.14 22.05,58 12.15,58 11.21,57.05 11.21,42.21 10.61,41.61 9.36,41.61 9.1,41.36 9.1,39.58 8.85,39.33 H2.1
PUMP_IN1: length 87.7
  Top Layer w0.254: U1.96 42.69,58.17 v1(42.48,58.38)
  Bottom Layer w0.254: CN6.2 7.7,23.45 8.21,23.96 8.21,38.18 8.59,38.56 9.36,38.56 9.86,39.07 9.86,40.6 10.12,40.85 10.88,40.85 11.92,41.89 11.92,56.5 12.53,57.11 22.31,57.11 23.96,58.76 23.96,65.74 24.47,66.25 41.99,66.25 42.48,65.76 42.48,59.56 42.48,59.56 42.48,59.08 42.48,59.07 v1(42.48,58.38)
PUMP_IN2: length 84.1
  Top Layer w0.254: U1.95 43.19,59.19 v1(43.06,59.32)
  Bottom Layer w0.254: CN6.1 7.32,28.53 7.83,29.04 7.83,38.69 8.09,38.95 8.97,38.95 9.48,39.45 9.48,40.98 9.74,41.23 10.75,41.23 11.56,42.04 11.56,56.9 12.21,57.55 22.12,57.55 23.58,59.01 23.58,66 24.21,66.63 42.5,66.63 43.06,66.07 v1(43.06,59.32)
PUMP_VREF: length 97.6
  Top Layer w0.254: U1.97 42.19,57.16 v1(41.87,57.49)
  Bottom Layer w0.254: CN6.3 7.96,18.37 8.59,19.01 8.59,37.93 8.85,38.18 9.48,38.18 10.88,39.58 15.58,39.58 15.96,39.96 15.96,42.12 15.58,42.5 12.66,42.5 12.4,42.76 12.4,56.22 12.91,56.73 22.56,56.73 24.34,58.5 24.34,65.36 24.72,65.74 38.31,65.74 39.07,64.98 41.36,64.98 41.61,64.73 41.61,57.74 v1(41.87,57.49)
REMOTE_DATA: length 22.4
  Top Layer w0.254: U1.87 47.2,54.5 47.2,59.27 46.57,59.9 41.49,59.9 40.98,60.41 40.98,67.9 40.47,68.41 39.66,68.41 R12.1 39.57,68.42 Q1.3
SPI3_CS: length 22.8
  Top Layer w0.254: U1.77 52.15,54.54 52.15,55.84 52.54,56.22 52.54,62.19 53.55,63.2 62.82,63.2 63.2,63.58 63.2,65.62 62.95,65.87 U12.1
SPI3_MISO: length 26
  Top Layer w0.254: v1(53.17,57.23) 53.8,57.23 54.06,57.49 54.06,62.19 54.57,62.69 63.2,62.69 63.71,63.2 63.71,66.76 63.33,67.14 U12.2 ; v1(51.53,57.23) 51.19,56.9 U1.79
  Bottom Layer w0.254: v1(51.53,57.23) v1(53.17,57.23)
SPI3_MOSI: length 25.7
  Top Layer w0.254: v1(45.7,56.21) 45.7,55.86 45.19,55.35 U1.91 ; U12.5 46.31,69.68 45.68,69.05 v1(45.68,60.79)
  Bottom Layer w0.254: v1(45.7,56.21) 45.68,56.22 v1(45.68,60.79)
SPI3_SCK: length 18.6
  Top Layer w0.254: U1.78 51.69,56.01 52.15,56.47 52.15,58.12 51.65,58.63 51.65,67.78 52.28,68.41 56.33,68.41
STEPPER_DECAY: length 41
  Top Layer w0.254: U13.8 82.76,49.87 82,49.11 82,42.12 81.62,41.74 59.27,41.74 59.01,41.99 59.01,43.39 58.46,43.95 U1.57
STEPPER_DIR: length 38.8
  Top Layer w0.254: 86.06,47.33 83.27,47.33 82.63,46.69 82.63,41.61 82.25,41.23 59.01,41.23 58.63,41.61 58.63,42.63 57.81,43.45 U1.56
STEPPER_MODE0: length 33.3
  Top Layer w0.254: U13.4 57.87,39.71 57.23,40.34 57.23,41.36 56.65,41.95 U1.53
STEPPER_MODE1: length 34.6
  Top Layer w0.254: U1.52 56.26,41.45 56.73,40.98 56.73,39.2 57.36,38.56 82.76,38.56 84.16,37.17 U13.3
STEPPER_MODE2: length 36.4
  Top Layer w0.254: 86.06,34.63 84.16,34.63 83.78,35.01 83.78,36.79 82.63,37.93 56.98,37.93 56.35,38.56 56.35,40.22 55.61,40.95 U1.51
STEPPER_NENBL: length 36.9
  Top Layer w0.254: U1.55 57.42,42.95 58.25,42.12 58.25,41.11 58.63,40.72 82.76,40.72 83.14,41.11 83.14,44.28 83.65,44.79 U13.6
STEPPER_NFLT: length 36.1
  Top Layer w0.254: v1(56.79,47.28) 56.46,46.95 U1.63
  Bottom Layer w0.254: v1(56.79,47.28) 56.79,47.54 56.83,47.57 56.83,49.39 57.61,50.18 66.06,50.18 66.51,50.63 66.51,52.03 66.89,52.41 86.06,52.41
STEPPER_NHOME: length 43.4
  Top Layer w0.254: U1.46 50.69,33.3 51.01,32.98 70.44,32.98 71.46,33.99 83.4,33.99 83.9,33.48 83.9,32.47 84.29,32.09 U13.1
STEPPER_NRST: length 39
  Top Layer w0.254: v1(55.7,48.35) 55.3,47.95 U1.65
  Bottom Layer w0.254: v1(55.7,48.35) 55.7,49.86 56.98,51.14 65.23,51.14 65.62,51.52 65.62,52.53 66.63,53.55 83.02,53.55 83.52,54.06 83.52,56.98 84.03,57.49 U13.11
STEPPER_NSLP: length 37.5
  Top Layer w0.254: v1(56.24,47.81) 55.88,47.45 U1.64
  Bottom Layer w0.254: U13.10 86,55.01 84.48,55.01 84.16,54.69 84.16,53.55 83.52,52.92 66.89,52.92 66.12,52.15 66.12,51.01 65.74,50.63 57.11,50.63 56.28,49.8 56.28,48.1 56.24,48.07 v1(56.24,47.81)
STEPPER_STEP: length 34.8
  Top Layer w0.254: 86.06,42.25 84.16,42.25 83.78,41.87 83.78,40.72 83.27,40.22 58.25,40.22 57.74,40.72 57.74,41.61 56.91,42.45 U1.54
SWCLK: length 51.8
  Top Layer w0.254: v1(68.41,70.06) 68.41,62.82 67.77,62.19 55.08,62.19 54.57,61.68 54.57,56.6 53.93,55.96 52.92,55.96 52.69,55.74 U1.76
  Bottom Layer w0.254: v1(68.41,70.06) 68.41,70.82 68.66,71.08 76.28,71.08 77.05,71.84 77.05,75.27 77.57,75.8 H1.5
SWDIO: length 51.1
  Top Layer w0.254: v1(67.39,61.42) 57.23,61.42 56.73,60.92 v1(56.73,54.95) ; U1.72 55.92,51.45 v1(55.96,51.49)
  Bottom Layer w0.254: v1(56.73,54.95) 56.73,51.77 56.44,51.49 v1(55.96,51.49) ; H1.4 85.22,73.24 77.94,73.24 77.55,72.86 77.55,71.08 76.92,70.44 72.22,70.44 71.71,69.93 71.71,61.93 71.2,61.42 v1(67.39,61.42)
UART5_RX: length 24
  Top Layer w0.254: U1.83 v1(49.19,62.31)
  Bottom Layer w0.254: v1(49.19,62.31) 49.23,62.35 49.23,70.19 48.73,70.7 45.55,70.7 44.53,71.71 U28.2
UART5_TX: length 23.3
  Top Layer w0.254: v1(50.76,62.31) 50.69,62.25 U1.80
  Bottom Layer w0.254: v1(50.76,62.31) 50.76,70.7 50.25,71.2 47.58,71.2 47.07,71.71 47.07,74.63
USART1_RX: length 33.8
  Top Layer w0.254: v1(68.28,58.69) 61.62,58.69 60.92,58 60.92,51.39 60.41,50.88 56.09,50.88 55.15,49.95 U1.69
  Bottom Layer w0.254: v1(68.28,58.69) 71.9,58.69 73.24,60.03 U26.2
USART1_TX: length 33.1
  Top Layer w0.254: U1.68 55.42,49.45 56.35,50.38 60.79,50.38 61.42,51.01 61.42,57.36 61.92,57.86 v1(67.14,57.86)
  Bottom Layer w0.254: U26.1 72.35,57.49 71.98,57.86 v1(67.14,57.86)
VSEN_3V3: length 5.1
  Top Layer w0.254: R8.2 R6.1 70.8,22.56 70.8,23.98 71.08,24.26 71.97,24.26
VSEN_5V: length 5.8
  Top Layer w0.254: R11.2 R9.1 11.74,45.71 12.02,45.42 12.02,43.82 U5.4
$1N1804: length 84.7
  Top Layer w0.254: v1(35.74,38.69) C8.2 35.74,36.38 35.26,35.9 30.44,35.9 29.55,35.01 v1(28.91,35.01) ; v1(36.15,46.36) 36.24,46.45 U1.14 ; 7.98,76.79 10.37,76.79 10.62,76.54 10.62,74.76 v1(10.62,74.76) ; v1(10.62,42.45) v1(10.62,37.75)
  Bottom Layer w0.254: v1(10.62,74.76) v1(10.62,42.45) ; v1(36.15,46.36) 35.41,45.62 35.41,39.03 v1(35.74,38.69) ; v1(10.62,37.75) 10.62,34.76 11.26,34.12 16.72,34.12 16.98,34.37 16.98,34.75 17.23,35.01 29.04,35.01
$1N1806: length 4.1
  Top Layer w0.254: C5.2 51.94,37.46 52.19,37.72 U1.49
$1N1807: length 3.4
  Top Layer w0.254: 57.55,52.15 55.8,52.15 55.6,51.95 U1.73
$1N1809: length 13.6
  Top Layer w0.254: U1.13 32.64,46.95 31.59,45.9 28.21,45.9 28.19,45.88 C3.2
$1N1810: length 16
  Top Layer w0.254: C2.2 26.53,48.12 X3.3 26.51,47.21 26.72,47 32.12,47 32.57,47.45 U1.12
$1N1813: length 19.9
  Top Layer w0.254: 33.54,62.87 33.54,61.72 32.64,60.82 32.64,59.56 32.82,59.38 C7.2 35.36,49.92 35.83,49.45 U1.8
$1N1814: length 25.5
  Top Layer w0.254: U1.9 35.76,48.95 34.95,49.75 34.95,52.99 34.47,53.47 30.15,53.47 29.52,54.11 C9.2 32.06,59.38 32.24,59.56 32.24,60.79 31.04,61.99 31.04,62.87
$1N1837: length 3.8
  Top Layer w0.254: R3.1 37.79,42.75 37.99,42.95 U1.21
$1N1847: length 3.2
  Top Layer w0.254: R2.1 62.07,34.23 65.21,34.23
$1N1851: length 4.3
  Top Layer w0.254: R5.2 46.19,35.14 U1.37
$1N4692: length 2.5
  Top Layer w0.254: R14.1 LED2.1
$2N910: length 2.3
  Top Layer w0.508: C23.2 69.8,28.07 71.97,28.07
$2N911: length 23.1
  Top Layer w0.508: U2.8 78.49,28.07 79.08,28.66 79.08,32.34 78.19,33.23 72.98,33.23 72.37,32.62 D1.2 72.3,30.82 70.19,30.82 69.72,30.35 69.72,29.56 65.16,29.56 L1.2
$2N1501: length 3.5
  Top Layer w0.508: C31.2 17,46.31 16.21,46.31 15.89,45.99 U5.1
$2N1502: length 20
  Top Layer w0.508: L2.2 18.96,48.17 18.37,47.58 18.37,46.34 C31.1 18.42,43.35 18.59,43.19 19.39,43.19 19.9,42.68 19.9,37.46 19.58,37.15 17.63,37.15 17.61,37.17 16.34,37.17 15.89,37.62 U5.8
$2N1872: length 2.1
  Top Layer w0.254: R13.1 35.8,69.36 Q1.1
$2N5206: length 15.2
  Top Layer w1.016: U24.2 18.94,66.82 13.1,66.82 12.28,67.65 12.28,69.1 11.47,69.9 P1.2

## Copper pours and planes (outline as drawn; the poured copper is in the pictures)
3V3 on PWR: -11.5,100.59 103.81,100.59 103.81,-10.15 -11.5,-10.15
GND on Top Layer: -9.47,97.42 99.24,97.42 99.24,-6.98 -9.47,-6.98
GND on Bottom Layer: -15.57,96.78 106.99,96.78 106.99,-5.07 -15.57,-5.07
GND on GND: -8.46,101.99 98.86,101.99 98.86,-8.12 -8.46,-8.12
VIN_24V on Top Layer: 16.16,34.12 16.16,27.38 12.75,27.38 12.75,34.12
VIN_24V on Top Layer: 88.73,28.79 88.73,24.98 83.02,24.98 83.02,28.79

Small or netless copper shapes (teardrops, artwork), in the pictures only: 290 on Top Layer, 55 on Bottom Layer, 17 on PWR

## Text on the board
Bottom Silkscreen Layer: MasterCore | WaterSprayingRobot_v1_0_4
Top Silkscreen Layer: + | - | GND | SBUS | 5V | RX | TX | MD0 | NRST | NSLP | DCY | DIR | STEP | MD1 | MD2 | NFLT | NENA | NHM | SDA | SCL | PWR | BRA | REV | SPD | FG | IN2 | IN1 | VREF | RST | SWCLK | SWDIO | 3V3 | BT0 | REMOTE | SWD | BLDC2 | STEPPER | BLDC1 | BLDC4 | BLDC3 | PUMP
